# Altium project Accessory_Breakout_X1.PrjPcb
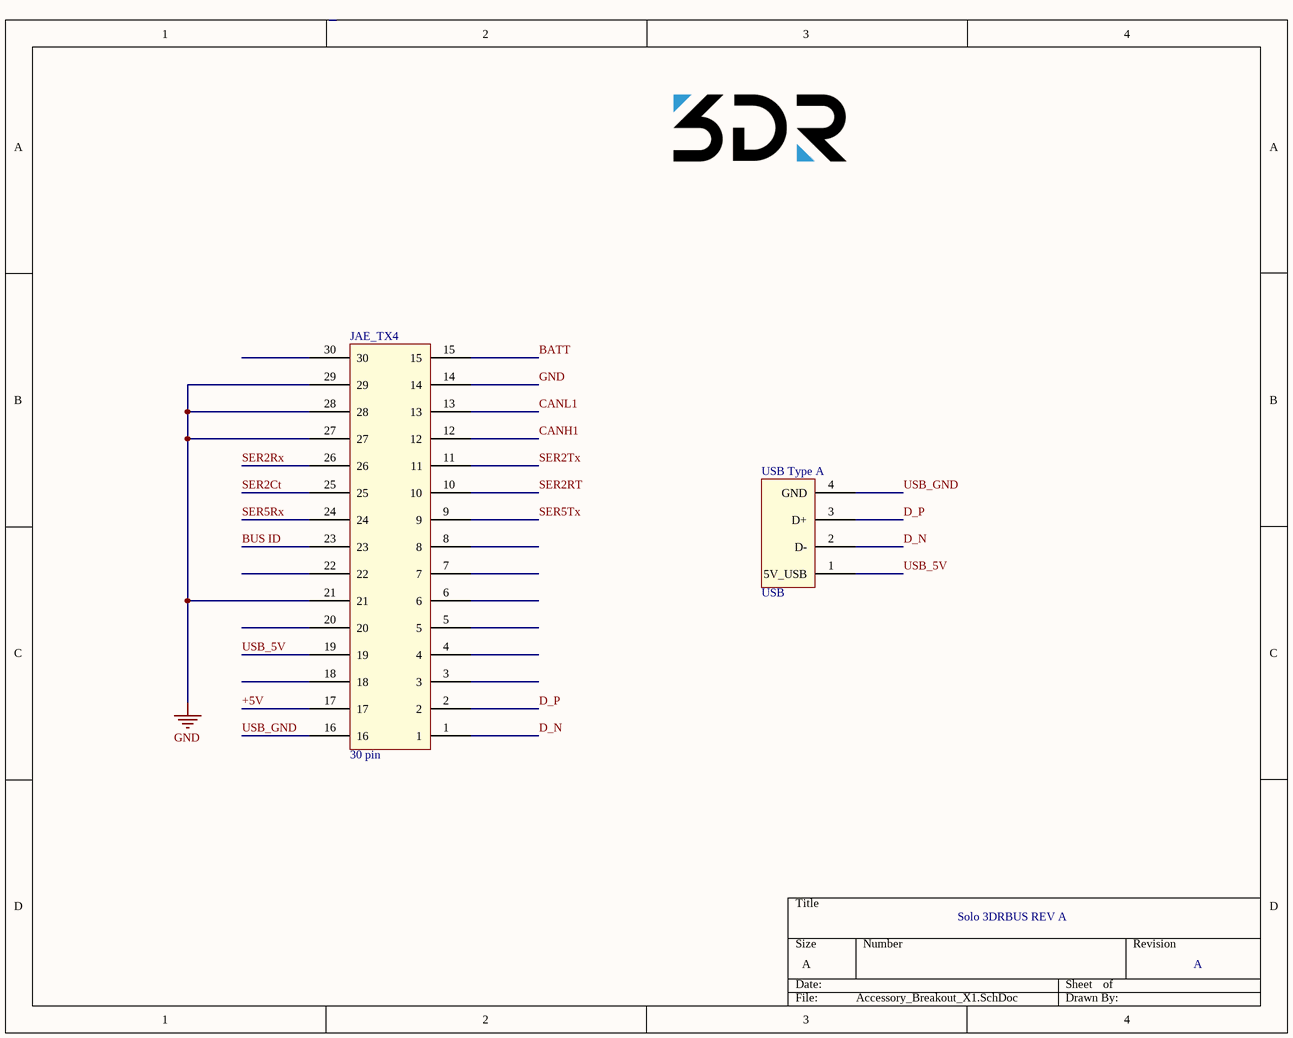
[diagram p0: Accessory_Breakout_X1.SchDoc]
1 sheet, 3 parts. Net scope: global (net labels, ports and power ports of the same name join across sheets).
Board file: version2.1.PcbDoc

## Sheet Accessory_Breakout_X1.SchDoc
size A; PageSetup: Record=PageOptions|CenterHorizontal=True|CenterVertical=True|PrintScale=1.00|XCorrection=1.00|YCorrection=1.00|PrintKind=1|BorderSize=5000000|LeftOffset=0|BottomOffset=0|Orientation=2|PaperLength=1000|PaperWidth=1000|Scale=100|PaperSource=7|PrintQuality=-3|MediaType=1|DitherType=10|PrintScaleMode=1|PaperKind=Letter (8.5 x 11")|PaperIndex=1

### Parts
3DR_Logo  DO NOT PLACE  [3DR_Large]  (value not drawn)
JAE_TX4  30 pin  [TX_24]
USB_Type_A  USB  [USB 2.0 SMD]

### Nets
GND: JAE_TX4.14 JAE_TX4.21 JAE_TX4.27 JAE_TX4.28 JAE_TX4.29
+5V: JAE_TX4.17
BATT: JAE_TX4.15
BUS ID: JAE_TX4.23
CANH1: JAE_TX4.12
CANL1: JAE_TX4.13
D_N: JAE_TX4.1 USB_Type_A.2(D-)
D_P: JAE_TX4.2 USB_Type_A.3(D+)
SER2Ct: JAE_TX4.25
SER2RT: JAE_TX4.10
SER2Rx: JAE_TX4.26
SER2Tx: JAE_TX4.11
SER5Rx: JAE_TX4.24
SER5Tx: JAE_TX4.9
USB_5V: JAE_TX4.19 USB_Type_A.1(5V_USB)
USB_GND: JAE_TX4.16 USB_Type_A.4(GND)

Not connected (* = marked no-connect by the designer): JAE_TX4 3 4 5 6 7 8 18 20 22 30

### Notes on the sheet
- Solo 3DRBUS REV A
- A

### Library data of the parts
3DR_Logo = 3DR_LOGO
JAE_TX4 = JAE_TX4
USB_Type_A = Component_1

## Assembly variants
Accessory_Breakout_X1: not fitted 3DR Logo CH6 CH7 CH8 P1 P2